# EAGLE design micro_mirror4 (EAGLE 8.2.2)
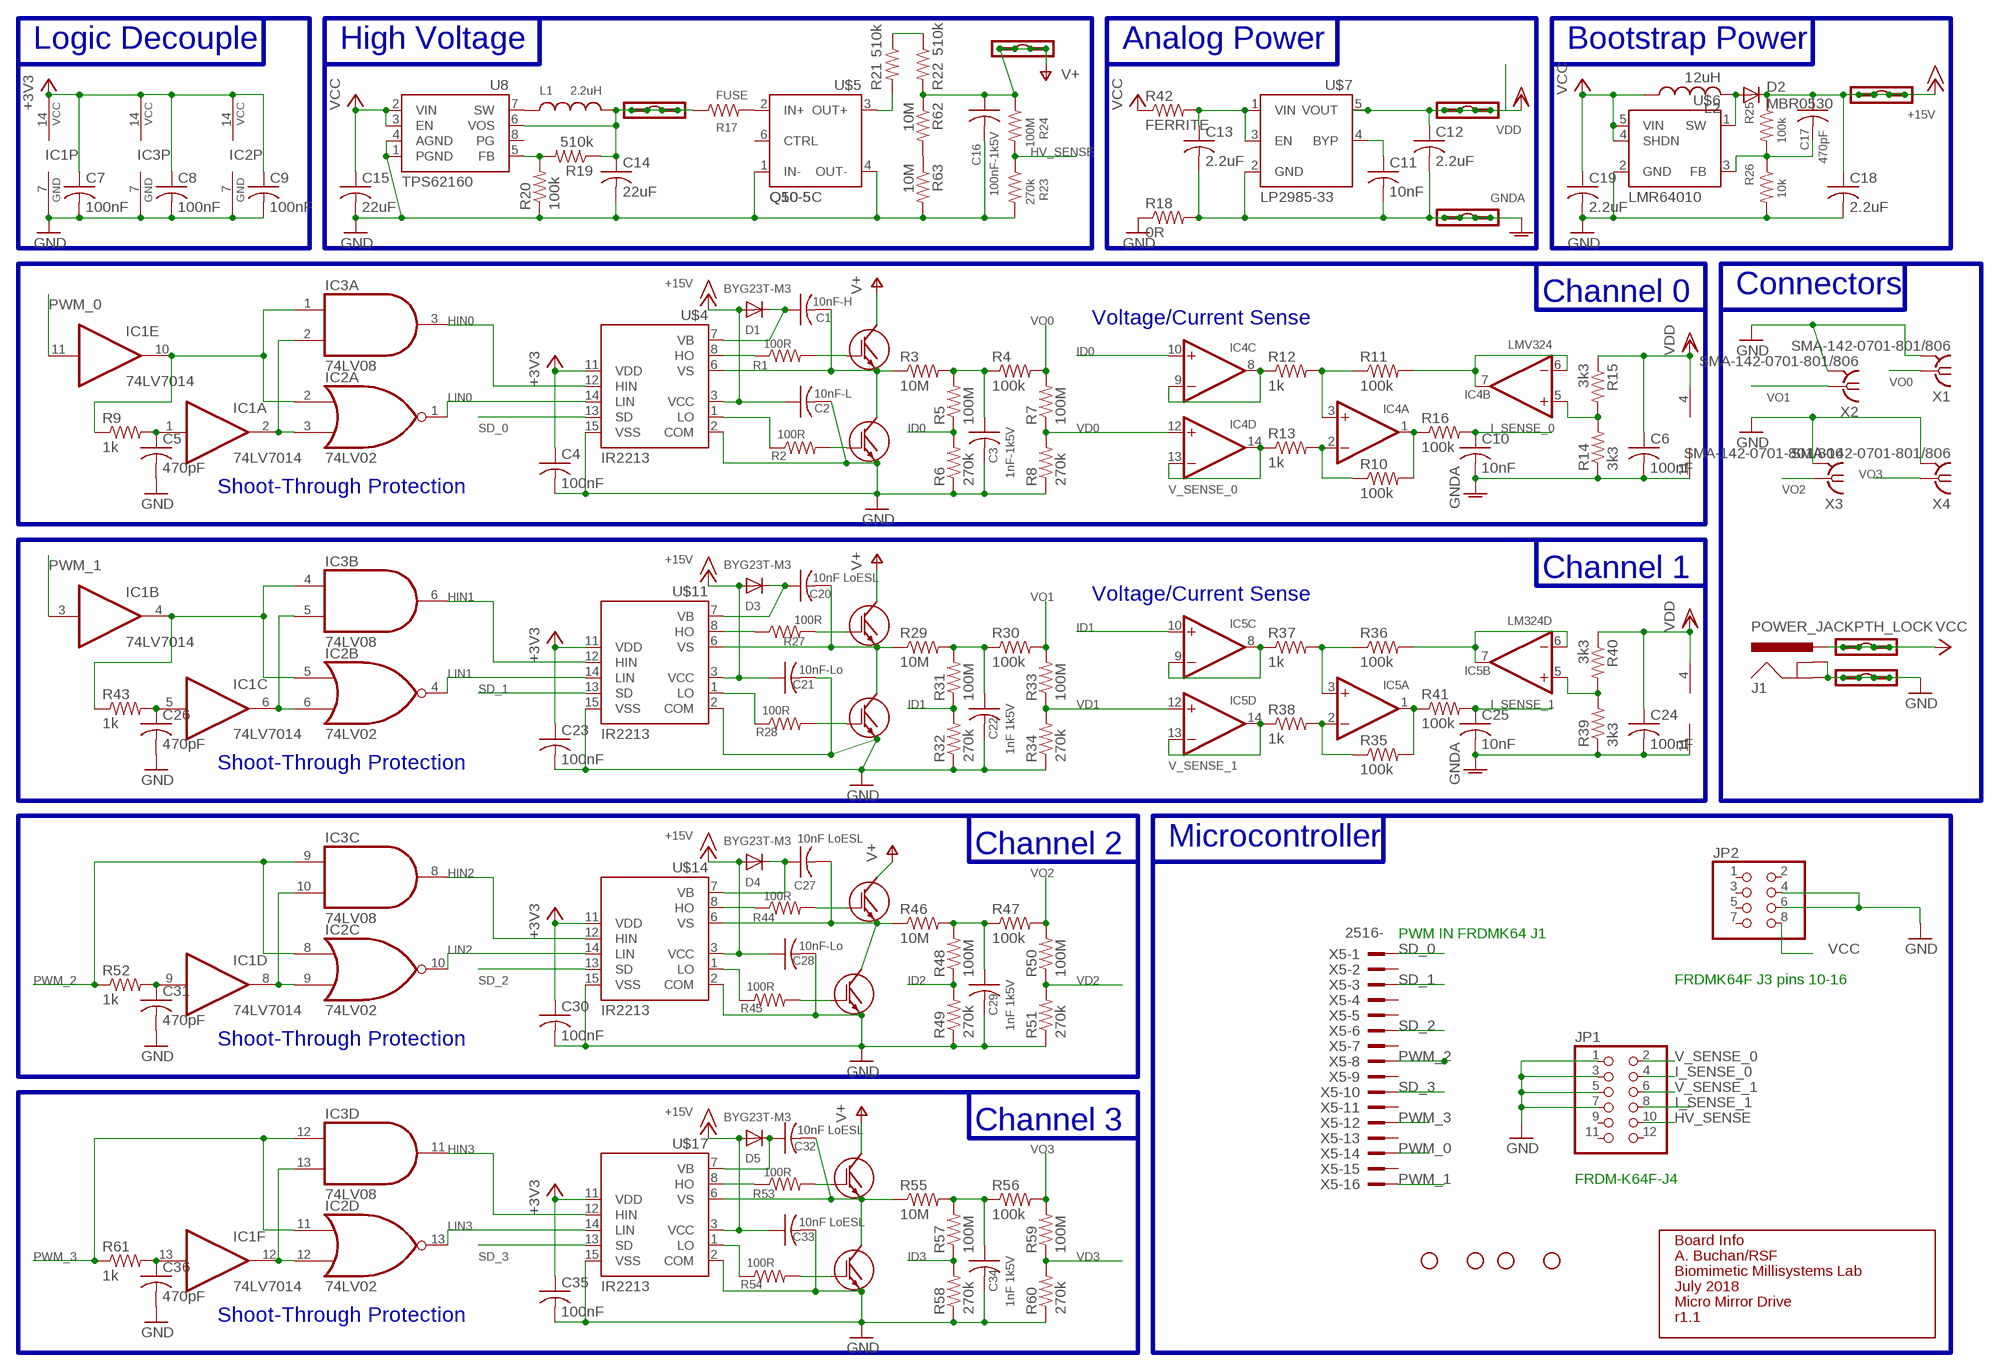
[diagram p0: schematic, sheet 1]

## Parts
15V_OUT  M04LOCK  [1X04_LOCK]
C1  10nF-H  C-USC1206  [C1206]
C2  10nF-L  C-USC1206  [C1206]
C3  1nF-1k5V  C-USC1206  [C1206]
C4  100nF  C-USC1206  [C1206]
C5  470pF  C-USC1206  [C1206]
C6  100nF  C-USC1206  [C1206]
C7  100nF  C-USC1206  [C1206]
C8  100nF  C-USC1206  [C1206]
C9  100nF  C-USC1206  [C1206]
C10  10nF  C-USC1206  [C1206]
C11  10nF  C-USC1206  [C1206]
C12  2.2uF  C-USC1206  [C1206]
C13  2.2uF  C-USC1206  [C1206]
C14  22uF  C-USC1206  [C1206]
C15  22uF  C-USC1206  [C1206]
C16  100nF-1k5V  C-USC2225K  [C2225K]
C17  470pF  C-USC1206  [C1206]
C18  2.2uF  C-USC1206  [C1206]
C19  2.2uF  C-USC1206  [C1206]
C20  10nF LoESL  C-USC1206  [C1206]
C21  10nF-Lo  C-USC1206  [C1206]
C22  1nF 1k5V  C-USC1206  [C1206]
C23  100nF  C-USC1206  [C1206]
C24  100nF  C-USC1206  [C1206]
C25  10nF  C-USC1206  [C1206]
C26  470pF  C-USC1206  [C1206]
C27  10nF LoESL  C-USC1206  [C1206]
C28  10nF-Lo  C-USC1206  [C1206]
C29  1nF 1k5V  C-USC1206  [C1206]
C30  100nF  C-USC1206  [C1206]
C31  470pF  C-USC1206  [C1206]
C32  10nF LoESL  C-USC1206  [C1206]
C33  10nF LoESL  C-USC1206  [C1206]
C34  1nF 1k5V  C-USC1206  [C1206]
C35  100nF  C-USC1206  [C1206]
C36  470pF  C-USC1206  [C1206]
D1  BYG23T-M3  DIODE-DO214AC  [DO214AC]
D2  MBR0530  DIODE-SOD123  [SOD123]
D3  BYG23T-M3  DIODE-DO214AC  [DO214AC]
D4  BYG23T-M3  DIODE-DO214AC  [DO214AC]
D5  BYG23T-M3  DIODE-DO214AC  [DO214AC]
GND  M04LOCK  [1X04_LOCK]
GNDA  M04LOCK  [1X04_LOCK]
H5  STAND-OFFTIGHT  [STAND-OFF-TIGHT]
H6  STAND-OFFTIGHT  [STAND-OFF-TIGHT]
H7  STAND-OFFTIGHT  [STAND-OFF-TIGHT]
H8  STAND-OFFTIGHT  [STAND-OFF-TIGHT]
HV_IN  M04LOCK  [1X04_LOCK]
HV_OUT  M04LOCK  [1X04_LOCK]
IC1  74LV7014  7407D  [SO14]
IC2  74LV02  7402D  [SO14]
IC3  74LV08  74S08D  [SO14]
IC4  LMV324  LINEAR_LM324D  [LINEAR_SO14]
IC5  LM324D  [SO14]
J1  POWER_JACKPTH_LOCK  [POWER_JACK_PTH_LOCK]
JP1  PINHD-2X6  [2X06]
JP2  PINHD-2X4  [2X04]
L1  2.2uH  INDUCTOR  [SRN6045]
L2  12uH  L-USL1812  [L1812]
R1  100R  R-US_R1206  [R1206]
R2  100R  R-US_R1206  [R1206]
R3  10M  R-US_R1206  [R1206]
R4  100k  R-US_R1206  [R1206]
R5  100M  R-US_R1206  [R1206]
R6  270k  R-US_R1206  [R1206]
R7  100M  R-US_R1206  [R1206]
R8  270k  R-US_R1206  [R1206]
R9  1k  R-US_R1206  [R1206]
R10  100k  R-US_R1206  [R1206]
R11  100k  R-US_R1206  [R1206]
R12  1k  R-US_R1206  [R1206]
R13  1k  R-US_R1206  [R1206]
R14  3k3  R-US_R1206  [R1206]
R15  3k3  R-US_R1206  [R1206]
R16  100k  R-US_R1206  [R1206]
R17  FUSE  R-US_R1206  [R1206]
R18  0R  R-US_R1206  [R1206]
R19  510k  R-US_R1206  [R1206]
R20  100k  R-US_R1206  [R1206]
R21  510k  R-US_R1206  [R1206]
R22  510k  R-US_R1206  [R1206]
R23  270k  R-US_R1206  [R1206]
R24  100M  R-US_R1206  [R1206]
R25  100k  R-US_R1206  [R1206]
R26  10k  R-US_R1206  [R1206]
R27  100R  R-US_R1206  [R1206]
R28  100R  R-US_R1206  [R1206]
R29  10M  R-US_R1206  [R1206]
R30  100k  R-US_R1206  [R1206]
R31  100M  R-US_R1206  [R1206]
R32  270k  R-US_R1206  [R1206]
R33  100M  R-US_R1206  [R1206]
R34  270k  R-US_R1206  [R1206]
R35  100k  R-US_R1206  [R1206]
R36  100k  R-US_R1206  [R1206]
R37  1k  R-US_R1206  [R1206]
R38  1k  R-US_R1206  [R1206]
R39  3k3  R-US_R1206  [R1206]
R40  3k3  R-US_R1206  [R1206]
R41  100k  R-US_R1206  [R1206]
R42  FERRITE  R-US_R1206  [R1206]
R43  1k  R-US_R1206  [R1206]
R44  100R  R-US_R1206  [R1206]
R45  100R  R-US_R1206  [R1206]
R46  10M  R-US_R1206  [R1206]
R47  100k  R-US_R1206  [R1206]
R48  100M  R-US_R1206  [R1206]
R49  270k  R-US_R1206  [R1206]
R50  100M  R-US_R1206  [R1206]
R51  270k  R-US_R1206  [R1206]
R52  1k  R-US_R1206  [R1206]
R53  100R  R-US_R1206  [R1206]
R54  100R  R-US_R1206  [R1206]
R55  10M  R-US_R1206  [R1206]
R56  100k  R-US_R1206  [R1206]
R57  100M  R-US_R1206  [R1206]
R58  270k  R-US_R1206  [R1206]
R59  100M  R-US_R1206  [R1206]
R60  270k  R-US_R1206  [R1206]
R61  1k  R-US_R1206  [R1206]
R62  10M  R-US_R1206  [R1206]
R63  10M  R-US_R1206  [R1206]
U8  TPS62160  [TSSOP8]
U$2  HGTD1N120BNS  [TO252]
U$3  HGTD1N120BNS  [TO252]
U$4  IR2213  [SO16L]
U$5  Q50-5C  [Q50-5C]
U$6  LMR64010  [SOT23-5]
U$7  LP2985-33  [SOT23-5]
U$9  HGTD1N120BNS  [TO252]
U$10  HGTD1N120BNS  [TO252]
U$11  IR2213  [SO16L]
U$12  HGTD1N120BNS  [TO252]
U$13  HGTD1N120BNS  [TO252]
U$14  IR2213  [SO16L]
U$15  HGTD1N120BNS  [TO252]
U$16  HGTD1N120BNS  [TO252]
U$17  IR2213  [SO16L]
U$18  INFO  [INFO]
VCC  M04LOCK  [1X04_LOCK]
VDDA  M04LOCK  [1X04_LOCK]
X1  SMA-142-0701-801/806  [J502-ND-142-0701-801/806]
X2  SMA-142-0701-801/806  [J502-ND-142-0701-801/806]
X3  SMA-142-0701-801/806  [J502-ND-142-0701-801/806]
X4  SMA-142-0701-801/806  [J502-ND-142-0701-801/806]
X5  2516-  [PAK100/2500-16]

## Nets
+15V: 15V_OUT.1 15V_OUT.2 15V_OUT.3 15V_OUT.4 C2.1 C17.1 C18.1 C21.1 C28.1 C33.1 D1.A D2.C D3.A D4.A D5.A R25.1 U$4.3(VCC) U$11.3(VCC) U$14.3(VCC) U$17.3(VCC)
GND: C2.2 C3.2 C4.2 C5.2 C7.2 C8.2 C9.2 C14.2 C15.2 C16.2 C18.2 C19.2 C21.2 C22.2 C23.2 C26.2 C28.2 C29.2 C30.2 C31.2 C33.2 C34.2 C35.2 C36.2 GND.1 GND.2 GND.3 GND.4 IC1.7(P:GND) IC2.7(P:GND) IC3.7(P:GND) J1.GND J1.GNDBREAK JP1.1 JP1.3 JP1.5 JP1.7 JP2.4 JP2.6 R6.1 R8.1 R18.1 R20.1 R23.2 R26.2 R32.1 R34.1 R49.1 R51.1 R58.1 R60.1 R63.2 U8.1(PGND) U8.4(AGND) U$3.2(E) U$4.2(COM) U$4.15(VSS) U$5.1(IN-) U$5.4(OUT-) U$6.2(GND) U$10.2(E) U$11.2(COM) U$11.15(VSS) U$13.2(E) U$14.2(COM) U$14.15(VSS) U$16.2(E) U$17.2(COM) U$17.15(VSS) X1.G@1 X1.G@2 X1.G@3 X1.G@4 X2.G@1 X2.G@2 X2.G@3 X2.G@4 X3.G@1 X3.G@2 X3.G@3 X3.G@4 X4.G@1 X4.G@2 X4.G@3 X4.G@4
GNDA: C6.2 C10.2 C11.2 C12.2 C13.2 C24.2 C25.2 GNDA.1 GNDA.2 GNDA.3 GNDA.4 IC4.11(P:V-) IC5.11(P:V-) R14.1 R18.2 R39.1 U$7.2(GND)
HIN0: IC3.3(A:O) U$4.12(HIN)
HIN1: IC3.6(B:O) U$11.12(HIN)
HIN2: IC3.8(C:O) U$14.12(HIN)
HIN3: IC3.11(D:O) U$17.12(HIN)
HV_SENSE: JP1.10 R23.1 R24.2
I_SENSE_0: C10.1 JP1.4 R16.2
I_SENSE_1: C25.1 JP1.8 R41.2
ID0: IC4.10(C:+IN) R5.1 R6.2
ID1: IC5.10(C:+IN) R31.1 R32.2
ID2: R48.1 R49.2
ID3: R57.1 R58.2
LIN0: IC2.1(A:O) U$4.14(LIN)
LIN1: IC2.4(B:O) U$11.14(LIN)
LIN2: IC2.10(C:O) U$14.14(LIN)
LIN3: IC2.13(D:O) U$17.14(LIN)
N$1: R1.2 U$2.1(G)
N$2: R2.2 U$3.1(G)
N$3: C1.2 R3.1 U$2.2(E) U$3.3(C) U$4.6(VS)
N$4: C3.1 R3.2 R4.1 R5.2
N$5: C1.1 D1.C U$4.7(VB)
N$6: R1.1 U$4.8(HO)
N$7: R2.1 U$4.1(LO)
N$8: IC1.2(A:O) IC2.3(A:I1) IC3.2(A:I1)
N$9: IC4.8(C:OUT) IC4.9(C:-IN) R12.1
N$10: C5.1 IC1.1(A:I) R9.2
N$11: IC4.1(A:OUT) R10.2 R16.1
N$12: R17.2 U$5.2(IN+)
N$13: IC4.2(A:-IN) R10.1 R13.2
N$14: IC4.3(A:+IN) R11.1 R12.2
N$15: IC4.5(B:+IN) R14.2 R15.2
N$16: IC4.6(B:-IN) IC4.7(B:OUT) R11.2
N$17: L1.1 U8.7(SW)
N$18: C14.1 HV_IN.1 HV_IN.2 HV_IN.3 HV_IN.4 L1.2 R17.1 R19.1 U8.6(VOS)
N$19: C11.1 U$7.4(BYP)
N$20: R19.2 R20.2 U8.5(FB)
N$21: D2.A L2.2 U$6.1(SW)
N$22: R27.2 U$9.1(G)
N$23: C17.2 R25.2 R26.1 U$6.3(FB)
N$24: R21.1 R22.1
N$25: R28.2 U$10.1(G)
N$26: C20.2 R29.1 U$9.2(E) U$10.3(C) U$11.6(VS)
N$27: R27.1 U$11.8(HO)
N$28: R28.1 U$11.1(LO)
N$29: C20.1 D3.C U$11.7(VB)
N$30: C22.1 R29.2 R30.1 R31.2
N$31: IC5.8(C:OUT) IC5.9(C:-IN) R37.1
N$32: IC5.2(A:-IN) R35.1 R38.2
N$33: IC5.3(A:+IN) R36.1 R37.2
N$34: IC5.6(B:-IN) IC5.7(B:OUT) R36.2
N$35: IC5.1(A:OUT) R35.2 R41.1
N$36: IC5.5(B:+IN) R39.2 R40.2
N$37: C13.1 R42.2 U$7.1(VIN) U$7.3(EN)
N$38: IC1.6(C:O) IC2.6(B:I1) IC3.5(B:I1)
N$39: C26.1 IC1.5(C:I) R43.2
N$40: R44.2 U$12.1(G)
N$41: R45.2 U$13.1(G)
N$42: C27.2 R46.1 U$12.2(E) U$13.3(C) U$14.6(VS)
N$43: R44.1 U$14.8(HO)
N$44: R45.1 U$14.1(LO)
N$45: C27.1 D4.C U$14.7(VB)
N$46: C29.1 R46.2 R47.1 R48.2
N$47: IC1.8(D:O) IC2.9(C:I1) IC3.10(C:I1)
N$48: R53.2 U$15.1(G)
N$49: C31.1 IC1.9(D:I) R52.2
N$50: R54.2 U$16.1(G)
N$51: C32.2 R55.1 U$15.2(E) U$16.3(C) U$17.6(VS)
N$52: R53.1 U$17.8(HO)
N$53: R54.1 U$17.1(LO)
N$54: C32.1 D5.C U$17.7(VB)
N$55: C34.1 R55.2 R56.1 R57.2
N$56: IC1.12(F:O) IC2.12(D:I1) IC3.13(D:I1)
N$57: C36.1 IC1.13(F:I) R61.2
N$58: IC1.4(B:O) IC2.5(B:I0) IC3.4(B:I0) R43.1
N$59: IC1.10(E:O) IC2.2(A:I0) IC3.1(A:I0) R9.1
N$60: R21.2 U$5.3(OUT+)
N$62: R62.2 R63.1
PWM_0: IC1.11(E:I) X5.14
PWM_1: IC1.3(B:I) X5.16
PWM_2: IC2.8(C:I0) IC3.9(C:I0) R52.1 X5.8
PWM_3: IC2.11(D:I0) IC3.12(D:I0) R61.1 X5.12
SD_0: U$4.13(SD) X5.1
SD_1: U$11.13(SD) X5.3
SD_2: U$14.13(SD) X5.6
SD_3: U$17.13(SD) X5.10
V+: C16.1 HV_OUT.1 HV_OUT.2 HV_OUT.3 HV_OUT.4 R22.2 R24.1 R62.1 U$2.3(C) U$9.3(C) U$12.3(C) U$15.3(C)
V_SENSE_0: IC4.13(D:-IN) IC4.14(D:OUT) JP1.2 R13.1
V_SENSE_1: IC5.13(D:-IN) IC5.14(D:OUT) JP1.6 R38.1
VCC: C15.1 C19.1 J1.PWR JP2.8 L2.1 R42.1 U8.2(VIN) U8.3(EN) U$6.4(SHDN) U$6.5(VIN) VCC.1 VCC.2 VCC.3 VCC.4
VD0: IC4.12(D:+IN) R7.1 R8.2
VD1: IC5.12(D:+IN) R33.1 R34.2
VD2: R50.1 R51.2
VD3: R59.1 R60.2
VDD: C6.1 C24.1 IC4.4(P:V+) IC5.4(P:V+) R15.1 R40.1
VDDA: C4.1 C7.1 C8.1 C9.1 C12.1 C23.1 C30.1 C35.1 IC1.14(P:VCC) IC2.14(P:VCC) IC3.14(P:VCC) U$4.11(VDD) U$7.5(VOUT) U$11.11(VDD) U$14.11(VDD) U$17.11(VDD) VDDA.1 VDDA.2 VDDA.3 VDDA.4 ; supply symbol labelled +3V3, VDD
VO0: R4.2 R7.2 X1.1
VO1: R30.2 R33.2 X2.1
VO2: R47.2 R50.2 X3.1
VO3: R56.2 R59.2 X4.1
Unconnected: JP1.9 JP1.11 JP1.12 JP2.1 JP2.2 JP2.3 JP2.5 JP2.7 U8.8(PG) U$5.6(CTRL) X5.2 X5.4 X5.5 X5.7 X5.9 X5.11 X5.13 X5.15

## Buses
B$1
B$2
B$3
B$4
B$5
B$6
B$7
B$8

## Notes on the sheet
- Logic Decouple | High Voltage | Analog Power | Bootstrap Power
- Channel 0
- Connectors
- Voltage/Current Sense
- Shoot-Through Protection
- Channel 1
- Voltage/Current Sense
- Shoot-Through Protection
- Channel 2
- Microcontroller
- PWM IN FRDMK64 J1
- FRDMK64F J3 pins 10-16
- Shoot-Through Protection
- Channel 3
- FRDM-K64F-J4
- Shoot-Through Protection

## Library data of the parts
15V_OUT GND GNDA HV_IN HV_OUT VCC VDDA = modular_robotics:M04: Header 4 Standard 4-pin 0.1" header. Use with straight break away headers (SKU : PRT-00116), right angle break away headers (PRT-00553), swiss pins (PRT-00743), machine pins (PRT-00117), and female headers (PRT-00115). Molex polarized connector foot print use with SKU : PRT-08231 with associated crimp pins and housings. 1MM SMD Version SKU: PRT-10208
C1-C36 = rcl:C-US: CAPACITOR, American symbol
D1-D5 = diode:DIODE-: DIODE
H5-H8 = SparkFun-Hardware:STAND-OFF: Stand Off Drill holes for mechanically mounting via screws, standoffs, etc. Note: Use the keepout ring to avoid running the screw head into surrounding components. Variant Overviews STAND-OFF - Mechanical footprint for a #4 phillips button head screw. STAND-OFF-TIGHT - Mechanical footprint for a #4 phillips button head screw, Example SparkFun Products Screw - Phillips Head (1/4", 4-40, 10 pack) <https://www.sparkfun.com/products/10453> (PRT-10453) Screw - Phillips Head (1/2", 4-40, 10 pack) <https://www.sparkfun.com/products/10452> (PRT-10452) Screw - Phillips Head (3/4", 4-40, 10 pack) <https://www.sparkfun.com/products/10451> (PRT-10451) Screw - Phillips Head (1", 4-40, 10 pack) <https://www.sparkfun.com/products/10450> (PRT-10450)
IC1 = 74xx-us:74*07: Hex BUFFER, open collector high-voltage output
IC2 = 74xx-us:74*02: Quad 2-input NOR gate
IC3 = 74xx-us:74*08: Quad 2-input AND gate
IC4 = micro_mirror3:LINEAR_LM324: OP AMP; VERSION: LMV324
IC5 = linear:LM324: OP AMP
J1 = SparkFun-Connectors:POWER_JACK: Power Jack This is the standard 5.5mm barrel jack for power. The PTH is the most common, proven, reliable, footprint. The Slot footprint only works if the mill layer is transmitted to the PCB fab house so be warned. Mating wall wart : TOL-00298 (and others); DIMENSIONS: 5.5mm-diam; PROD_ID: PRT-00119
JP1 = pinhead:PINHD-2X6: PIN HEADER
JP2 = pinhead:PINHD-2X4: PIN HEADER
L1 = modular_robotics:INDUCTOR
L2 = rcl:L-US: INDUCTOR, American symbol
R1-R63 = rcl:R-US_: RESISTOR, American symbol
U8 = modular_robotics:TPS62160
U$2 U$3 U$9 U$10 U$12 U$13 U$15 U$16 = modular_robotics:HGTD1N120BNS
U$4 U$11 U$14 U$17 = modular_robotics:IR2213
U$5 = modular_robotics:Q50-5C; EMCO: Q10-5
U$6 = modular_robotics:LMR64010
U$7 = modular_robotics:LP2985-33
U$18 = modular_robotics:INFO; AUTHOR: A. Buchan/RSF; DATE: July 2018; DESIGN: Micro Mirror Drive; ORGANIZATION: Biomimetic Millisystems Lab; REVISION: r1.1
X1-X4 = con-coax:SMA-: SMA 50 Ohm End Launch Jack Receptacle - Round Contact Johnson Components Source: www.johnsoncomponents.com .. J502-ND.pdf; MF: JOHNSON COMPONENTS; MPN: 142-0701-801; OC_FARNELL: 1608592; OC_NEWARK: 90F2624
X5 = con-3m:2516-: 3M (TM) Pak 100 4-Wall Header Source: 3M; OC_FARNELL: unknown; OC_NEWARK: unknown

## Net classes
0 default: clearance 0.205 mm

## Board
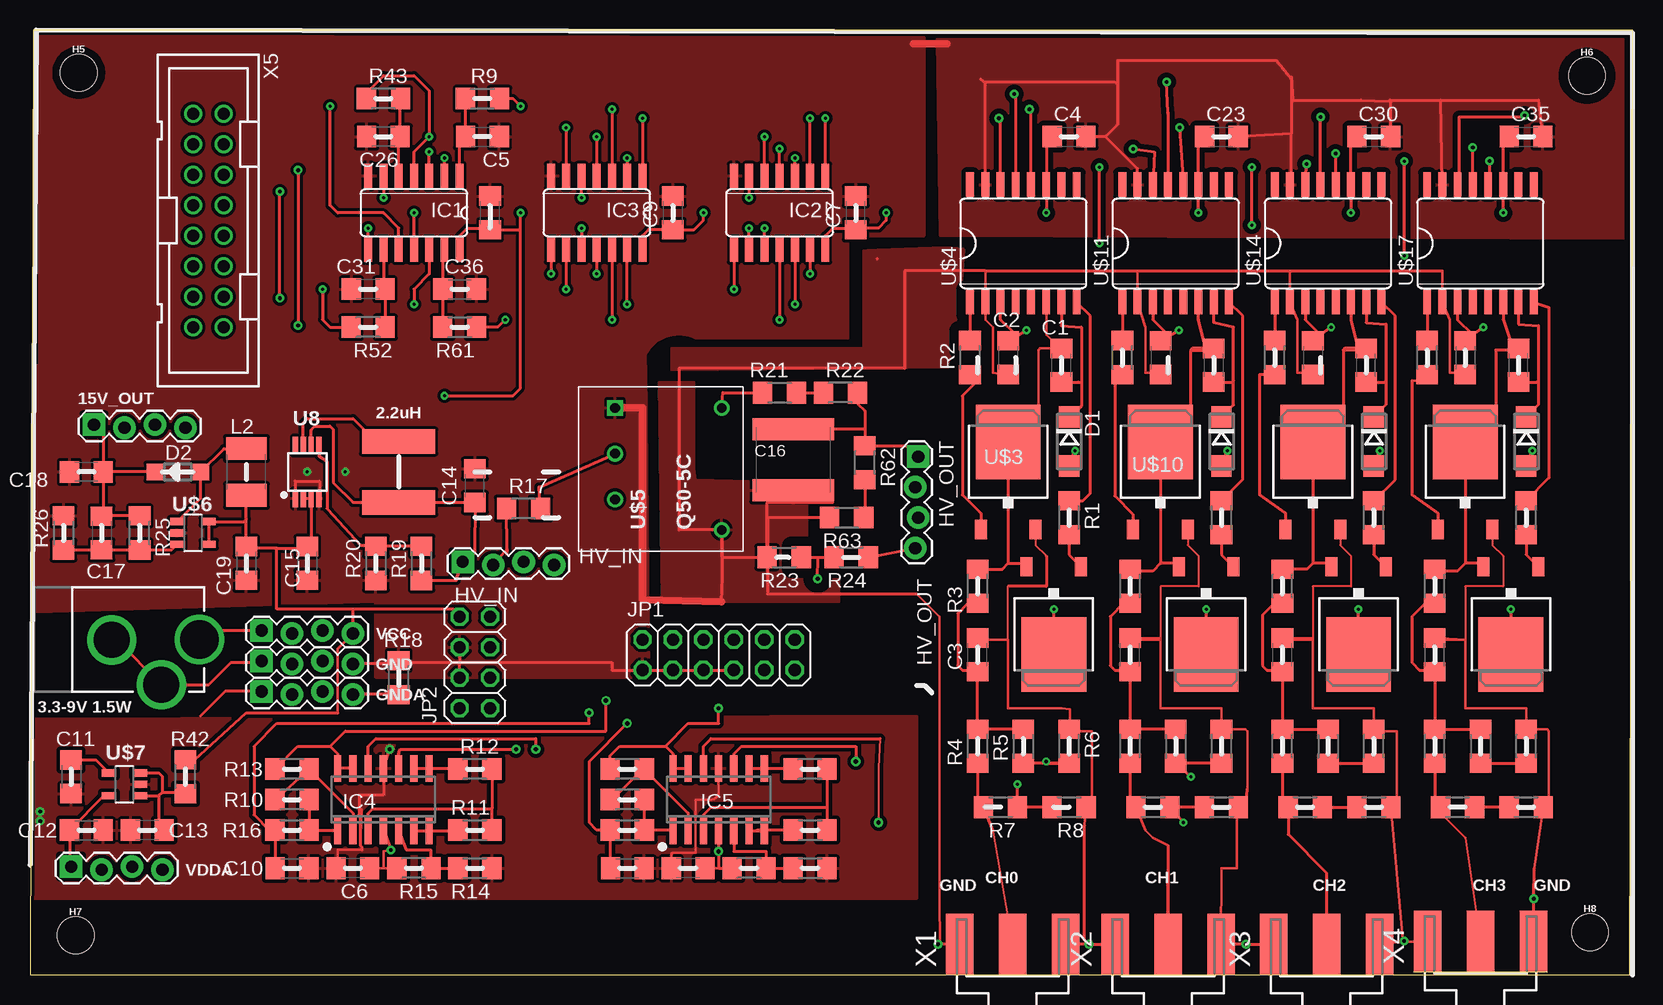
[diagram p1: board, top side]
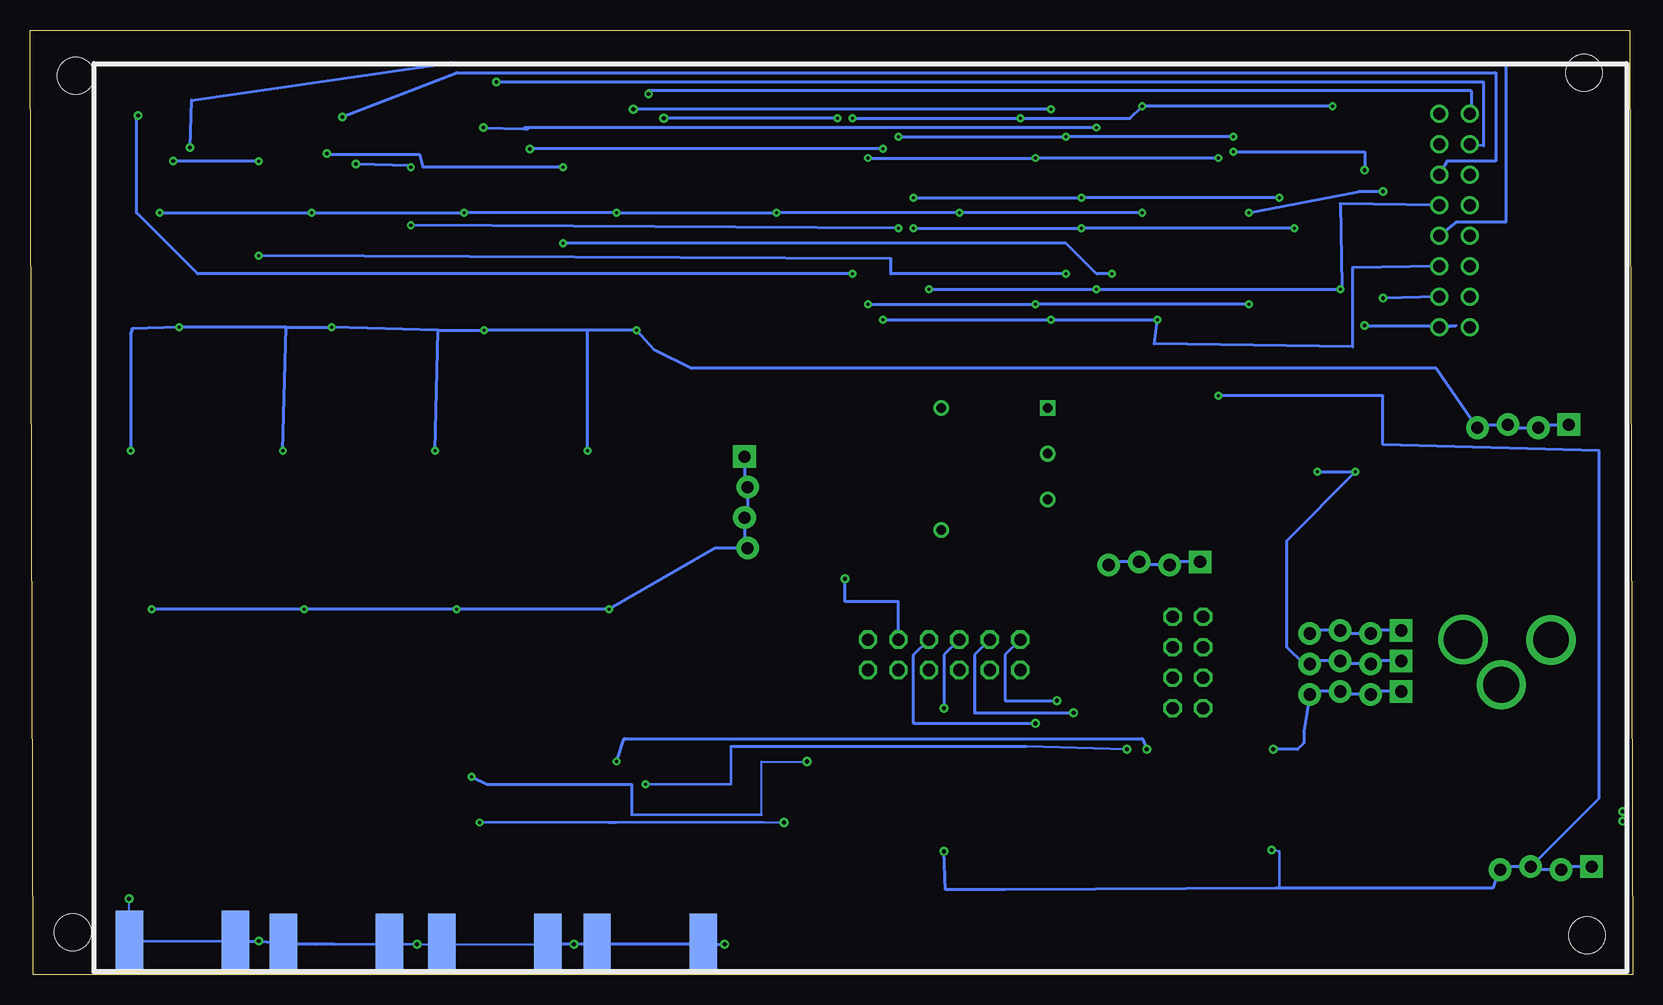
[diagram p2: board, bottom side, seen from below]

Size 133.6 x 78.74 mm. Coordinates in mm from the lower left corner, seen from the top.
Outline: 0,0 133.35,0 133.6,78.74 0.25,78.74 0,0
Copper layers (1*16): Top 0.035mm / dielectric 1.5mm / Bottom 0.035mm
Design rules "default *": minimum track width 6mil, minimum drill 10mil, track to track 6mil, track to pad 6mil, pad to pad 6mil, via to via 6mil, smd to smd 6mil, copper to edge 10mil, drill to drill 8mil, minimum pad ring 10mil, minimum via ring 8mil, stop-mask expansion 4mil, vias tented up to drill 0mil, thermal gap 10mil

### Footprints (pad centres in the part's own frame; a part is rotated, then mirrored left to right if it is on the bottom)
1X04_LOCK = drill 1.016 pad 1.88 square: 1 0,0.127 | drill 1.016 pad 1.88: 2 2.54,-0.127; 3 5.08,0.127; 4 7.62,-0.127
C1206 = smd 1.6 x 1.8: 1 -1.4,0; 2 1.4,0
C2225K = smd 1.85 x 6.8: 1 -2.55,0; 2 2.55,0
DO214AC = smd 1.8 x 1.7: A 2.05,0; C -2.05,0
SOD123 = smd 1.4 x 1.4: A 1.9,0; C -1.9,0
STAND-OFF-TIGHT = hole 3.048: 0,0
SO14 = smd 0.66 x 2.032: 1 -3.81,-3.073; 2 -2.54,-3.073; 3 -1.27,-3.073; 4 0,-3.073; 5 1.27,-3.073; 6 2.54,-3.073; 7 3.81,-3.073; 8 3.81,3.073; 9 2.54,3.073; 10 1.27,3.073; 11 0,3.073; 12 -1.27,3.073; 13 -2.54,3.073; 14 -3.81,3.073
LINEAR_SO14 = smd 0.6 x 2.2: 1 -3.81,-2.6; 2 -2.54,-2.6; 3 -1.27,-2.6; 4 0,-2.6; 5 1.27,-2.6; 6 2.54,-2.6; 7 3.81,-2.6; 8 3.81,2.6; 9 2.54,2.6; 10 1.27,2.6; 11 0,2.6; 12 -1.27,2.6; 13 -2.54,2.6; 14 -3.81,2.6
SO14' = smd 0.6 x 2.2: 1 -3.81,-2.6; 2 -2.54,-2.6; 3 -1.27,-2.6; 4 0,-2.6; 5 1.27,-2.6; 6 2.54,-2.6; 7 3.81,-2.6; 8 3.81,2.6; 9 2.54,2.6; 10 1.27,2.6; 11 0,2.6; 12 -1.27,2.6; 13 -2.54,2.6; 14 -3.81,2.6
POWER_JACK_PTH_LOCK = drill 2.997 pad 4.115: GND 0.025,6.557; GNDBREAK 3.762,10.7 | drill 3.2 pad 4.115: PWR 0,13.878
2X06 = drill 1.016 octagon: 1 -6.35,-1.27; 2 -6.35,1.27; 3 -3.81,-1.27; 4 -3.81,1.27; 5 -1.27,-1.27; 6 -1.27,1.27; 7 1.27,-1.27; 8 1.27,1.27; 9 3.81,-1.27; 10 3.81,1.27; 11 6.35,-1.27; 12 6.35,1.27
2X04 = drill 1.016 octagon: 1 -3.81,-1.27; 2 -3.81,1.27; 3 -1.27,-1.27; 4 -1.27,1.27; 5 1.27,-1.27; 6 1.27,1.27; 7 3.81,-1.27; 8 3.81,1.27
SRN6045 = smd 2.032 x 6.096: 1 -2.54,0; 2 2.54,0
L1812 = smd 1.9 x 3.4: 1 -1.95,0; 2 1.95,0
R1206 = smd 1.6 x 1.803: 1 -1.422,0; 2 1.422,0
TSSOP8 = smd 0.45 x 1.45: 1 -0.975,-2.2; 2 -0.325,-2.2; 3 0.325,-2.2; 4 0.975,-2.2; 5 0.975,2.2; 6 0.325,2.2; 7 -0.325,2.2; 8 -0.975,2.2
TO252 = smd 1 x 1.6: 1 -2.28,-4.8; 2 2.28,-4.8 | smd 5.4 x 6.2: 3 0,2.5
SO16L = smd 0.66 x 2.032: 1 -4.445,-4.902; 2 -3.175,-4.902; 3 -1.905,-4.902; 4 -0.635,-4.902; 5 0.635,-4.902; 6 1.905,-4.902; 7 3.175,-4.902; 8 4.445,-4.902; 9 4.445,4.902; 10 3.175,4.902; 11 1.905,4.902; 12 0.635,4.902; 13 -0.635,4.902; 14 -1.905,4.902; 15 -3.175,4.902; 16 -4.445,4.902
Q50-5C = drill 0.8 square: 1 0,0 | drill 0.8: 2 0,-3.81; 3 8.89,0; 4 8.89,-10.16; 6 0,-7.62
SOT23-5 = smd 0.6 x 1.2: 1 -0.95,-1.306; 2 0,-1.306; 3 0.95,-1.306; 4 0.95,1.306; 5 -0.95,1.306
J502-ND-142-0701-801/806 = smd 5.08 x 2.286: 1 2.565,0; G@1 2.565,4.42; G@2 2.565,-4.42 | smd 5.08 x 2.286 bottom: G@3 2.565,4.42; G@4 2.565,-4.42
PAK100/2500-16 = drill 1 pad 1.422: 1 -8.89,-1.27; 2 -8.89,1.27; 3 -6.35,-1.27; 4 -6.35,1.27; 5 -3.81,-1.27; 6 -3.81,1.27; 7 -1.27,-1.27; 8 -1.27,1.27; 9 1.27,-1.27; 10 1.27,1.27; 11 3.81,-1.27; 12 3.81,1.27; 13 6.35,-1.27; 14 6.35,1.27; 15 8.89,-1.27; 16 8.89,1.27

### Placement (x,y rotation side)
15V_OUT  5.33,45.72 0 top
C1  85.98,50.8 90 top
C2  81.53,51.44 270 top
C3  78.99,26.67 90 top
C4  86.61,69.85 0 top
C5  37.72,69.85 0 top
C6  26.92,8.89 180 top
C7  68.83,63.5 90 top
C8  38.35,63.5 90 top
C9  53.59,63.5 90 top
C10  21.84,8.89 0 top
C11  3.43,16.51 270 top
C12  4.7,12.06 0 top
C13  9.78,12.06 180 top
C14  37.08,40.77 90 top
C15  23.11,34.29 270 top
C16  63.63,42.93 270 top
C17  5.97,36.83 270 top
C18  4.7,41.91 180 top
C19  18.03,34.29 270 top
C20  98.68,50.8 90 top
C21  94.23,51.44 270 top
C22  91.69,26.67 90 top
C23  99.31,69.85 0 top
C24  54.86,8.89 180 top
C25  49.78,8.89 0 top
C26  29.46,69.85 180 top
C27  111.38,50.8 90 top
C28  106.93,51.44 270 top
C29  104.39,26.67 90 top
C30  112.01,69.85 0 top
C31  28.19,57.15 180 top
C32  124.08,50.8 90 top
C33  119.63,51.44 270 top
C34  117.09,26.67 90 top
C35  124.71,69.85 0 top
C36  35.81,57.15 0 top
D1  86.61,44.45 270 top
D2  12.32,41.91 0 top
D3  99.31,44.45 270 top
D4  112.01,44.45 270 top
D5  124.71,44.45 270 top
GND  19.3,26.04 0 top
GNDA  19.3,23.5 0 top
H5  4.06,75.18 0 top
H6  129.79,74.93 0 top
H7  3.81,3.3 0 top
H8  130.05,3.56 0 top
HV_IN  36.07,34.29 0 top
HV_OUT  73.91,43.18 270 top
IC1  32,63.5 180 top
IC2  62.48,63.5 180 top
IC3  47.24,63.5 180 top
IC4  29.46,14.61 0 top
IC5  LM324D  [SO14']  57.4,14.61 0 top
J1  0.25,27.94 270 top
JP1  57.4,26.67 0 top
JP2  37.08,26.04 90 top
L1  30.73,41.91 270 top
L2  18.03,41.91 90 top
R1  86.61,38.1 270 top
R2  78.36,51.44 270 top
R3  78.99,32.38 270 top
R4  78.99,19.05 270 top
R5  82.8,19.05 90 top
R6  86.61,19.05 270 top
R7  80.9,13.97 180 top
R8  86.61,13.97 180 top
R9  37.72,73.03 180 top
R10  21.84,14.61 0 top
R11  37.08,12.06 180 top
R12  37.08,17.14 0 top
R13  21.84,17.14 0 top
R14  37.08,8.89 180 top
R15  32,8.89 0 top
R16  21.84,12.06 180 top
R17  41.15,38.86 0 top
R18  30.73,24.77 270 top
R19  32.64,34.29 90 top
R20  28.83,34.29 90 top
R21  62.48,48.51 180 top
R22  67.56,48.51 0 top
R23  62.86,34.8 180 top
R24  68.45,34.8 180 top
R25  9.14,36.83 270 top
R26  2.79,36.83 90 top
R27  99.31,38.1 270 top
R28  91.06,51.44 270 top
R29  91.69,32.38 270 top
R30  91.69,19.05 270 top
R31  95.5,19.05 90 top
R32  99.31,19.05 270 top
R33  93.6,13.97 180 top
R34  99.31,13.97 180 top
R35  49.78,14.61 0 top
R36  65.02,12.06 180 top
R37  65.02,17.14 0 top
R38  49.78,17.14 0 top
R39  65.02,8.89 180 top
R40  59.94,8.89 0 top
R41  49.78,12.06 180 top
R42  12.95,16.51 270 top
R43  29.46,73.03 0 top
R44  112.01,38.1 270 top
R45  103.76,51.44 270 top
R46  104.39,32.38 270 top
R47  104.39,19.05 270 top
R48  108.2,19.05 90 top
R49  112.01,19.05 270 top
R50  106.3,13.97 180 top
R51  112.01,13.97 180 top
R52  28.19,53.98 0 top
R53  124.71,38.1 270 top
R54  116.46,51.44 270 top
R55  117.09,32.38 270 top
R56  117.09,19.05 270 top
R57  120.9,19.05 90 top
R58  124.71,19.05 270 top
R59  119,13.97 180 top
R60  124.71,13.97 180 top
R61  35.81,53.98 180 top
R62  69.6,42.67 270 top
R63  68.07,38.1 180 top
U8  23.11,41.91 0 top
U$2  85.34,29.21 180 top
U$3  81.53,41.91 0 top
U$4  82.8,60.96 0 top
U$5  48.77,47.24 0 top
U$6  13.59,36.83 270 top
U$7  7.87,15.88 90 top
U$9  98.04,29.21 180 top
U$10  94.23,41.91 0 top
U$11  95.5,60.96 0 top
U$12  110.74,29.21 180 top
U$13  106.93,41.91 0 top
U$14  108.2,60.96 0 top
U$15  123.44,29.21 180 top
U$16  119.63,41.91 0 top
U$17  120.9,60.96 0 top
U$18  54.36,72.52 0 top
VCC  19.3,28.57 0 top
VDDA  3.43,8.89 0 top
X1  81.92,0 90 top
X2  94.87,0 90 top
X3  108.08,0 90 top
X4  120.9,0.25 90 top
X5  14.86,62.87 270 top

### Tracks (layer width: path | path; a pad name or v marks a point on that pad's centre or on a via)
+15V  (via drill 0.25)
  Top 0.254: U$4.3 80.9,54.61 82.17,53.34 C2.1 v83.06,53.72 | U$11.3 93.6,54.61 94.87,53.34 C21.1 v95.76,53.72 | R25.1 5.99,38.25 C17.1 6.1,38.36 C18.1 | D2.C C18.1 | 15V_OUT.1 6.1,45.08 C18.1 | D1.A v87.12,43.69 | D3.A v99.82,43.69 | U$14.3 106.3,54.61 107.57,53.34 C28.1 v108.46,53.98 | U$17.3 119,54.61 120.27,53.34 C33.1 v121.16,53.98 | 124.71,42.55 D5.A v125.22,43.69 | D4.A v112.52,43.69
  Bottom 0.254: 87.12,53.72 v83.06,53.72 81.53,52.07 78.49,50.55 16.38,50.55 15V_OUT.4 12.7,45.85 15V_OUT.3 10.16,45.59 15V_OUT.2 7.62,45.85 15V_OUT.1 | 87.12,53.72 v95.76,53.72 99.57,53.72 | v87.12,43.69 87.12,53.72 | v99.82,43.69 99.57,53.72 | 99.57,53.72 v108.46,53.98 112.27,53.98 | v112.52,43.69 112.27,53.98 | 112.27,53.98 v121.16,53.98 125.09,53.85 125.22,53.47 v125.22,43.69
GND  (via drill 0.25, 0.3 pad 0.65, 0.35)
  Top 0.152: U$3.2 83.81,35.82 84.71,34.92 | 81.53,27.94 81.53,32.38 | U$10.2 96.51,35.82 97.41,34.92 97.41,32.38 94.23,32.38 94.23,27.94 | U$13.2 109.21,35.82 110.11,34.92 110.11,32.38 106.93,32.38 106.93,27.94 | U$16.2 121.91,35.82 122.81,34.92 122.81,32.38 119.63,32.38 119.63,27.94
  Top 0.203: C2.2 81.03,50.03 80.26,50.16 80.26,53.98 79.63,54.61 U$4.2 79.63,58.67 | C21.2 93.73,49.4 94.23,50.16 92.96,50.16 92.96,53.98 U$11.2 92.33,58.67 | C28.2 107.06,50.03 106.3,50.16 105.66,50.16 105.66,54.61 U$14.2 105.03,58.67 | C33.2 119.76,50.16 118.36,50.16 118.36,54.61 U$17.2 117.73,58.67 | 117.09,27.94 119.63,27.94 | C34.2 117.6,28.07 119.63,27.94 | 119.63,27.94 119.63,22.23 124.71,22.23 R58.1 126.47,20.47 126.62,20.32 126.62,14.61 | 106.93,27.94 103.76,27.94 | C29.2 106.8,28.07 106.93,27.94 | 106.93,27.94 106.93,22.23 112.01,22.23 R49.1 112.17,20.32 113.92,20.32 113.92,13.97 | 94.23,27.94 91.69,27.94 | C22.2 94.1,28.07 94.23,27.94 | 94.23,27.94 94.23,22.23 99.31,22.23 R32.1 101.32,20.47 101.47,20.32 101.47,15.49 101.22,13.97 | 125.4,8.9 R60.1 126.39,13.72 126.75,13.72 | R51.1 114.45,2.95 | R34.1 100.58,13.82 100.58,8.89 99.31,8.89 X2.G@2 | 87.91,12.44 R8.1 | R6.1 86.69,20.4 | 86.69,20.4 86.77,20.32 88.52,20.32 88.52,14.61 87.88,13.97 | C3.2 79.12,27.94 81.53,27.94 81.53,22.23 85.98,22.23 86.69,22.15 86.69,20.4 | X1.G@1 75.84,2.56 75.82,6.35 75.82,29.84 73.91,31.75
  Top 0.254: 35.81,26.04 30.89,26.04 R18.1 31.09,25.91 GND.4 | 35.81,26.04 48.51,26.04 48.51,25.4 JP1.1 JP1.3 JP1.5 JP1.7 | J1.GND 7.22,27.91 J1.GNDBREAK 14.91,24.18 16.76,26.04 19.18,26.04 GND.1 | 84.71,34.92 84.71,32.38 81.53,32.38 | JP2.6 35.81,26.04 | JP2.4 35.81,26.04 | R60.1 126.62,14.61 | X4.G@2 v125.35,6.35 125.4,8.9 | 114.63,2.78 v114.54,2.82 X3.G@2 | 114.63,2.78 X4.G@1 | 114.45,2.95 114.63,2.78 | X3.G@1 v101.35,2.54 X2.G@2 | R34.1 101.35,13.97 101.47,15.49 | R51.1 113.92,13.97 | 92.2,65.99 U$11.15 92.33,67.18 89.66,69.85 | U$17.15 117.6,72.9 | 70.61,59.69 70.61,59.67 | 117.73,58.67 105.03,58.67 92.33,58.67 79.63,58.67 72.9,58.67 72.9,50.55 54.1,50.55 54.1,37.08 57.73,37.1 | 57.73,37.1 U$5.4 57.66,34.8 R23.2 61.44,39.34 62.99,39.37 66.92,39.37 C16.2 | 87.88,13.97 R8.1 88.65,13.97 | U$4.15 79.63,74.3 79.5,74.42 | 79.5,74.42 79.25,74.68 | 90.68,74.17 90.68,76.2 103.89,76.2 105.16,74.68 | 105.16,74.68 105.16,70.1 | 105.16,66.29 105.16,70.1 | 105.16,74.68 105.16,74.81 105.28,72.9 110.94,72.9 113.28,72.8 | 113.28,72.8 113.39,72.8 113.41,70.99 C30.2 | 117.6,72.9 125.73,72.9 125.98,70.74 C35.2 | 79.5,74.42 90.42,74.42 90.68,74.17 | 89.66,69.85 C4.2 | 89.66,69.85 90.68,70.87 90.68,74.17 | 105.16,70.1 C23.2 | 113.28,72.8 113.38,72.9 117.6,72.9 | X1.G@1 75.72,2.56 v75.69,2.54 | 86.36,2.59 X1.G@2 88.24,2.56 v88.27,2.54 | v88.27,2.54 87.91,2.9 87.91,12.44 | v88.27,2.54 90.42,2.54 X2.G@1 | U8.1 22.14,41.11 22.1,41.15 24.13,41.15 24.13,39.75 U8.4 | 57.66,31.11 57.72,33.15 57.73,37.1 | R63.2 61.47,38.1 61.47,31.75 73.91,31.75
  Top 0.61: U$5.1 51.05,47.24 51.05,31.24 57.66,31.11 | 73.66,77.6 76.45,77.6
  Bottom 0.152: X2.G@1 X2.G@2 X3.G@1 v101.35,2.54 | X4.G@2 v125.35,6.35
  Bottom 0.203: v101.35,2.54 108.2,2.54 | X4.G@1 X4.G@2
  Bottom 0.254: v26.29,41.91 v23.11,41.91 28.83,36.2 28.83,27.3 27.43,25.91 GND.4 26.67,26.16 GND.3 24.13,25.91 GND.2 21.59,26.16 GND.1 | v75.69,2.54 X1.G@1 86.36,2.56 | X4.G@1 v114.54,2.82 X3.G@2 109.73,2.54 108.2,2.54 | X1.G@2 86.36,2.56 | 86.36,2.56 88.39,2.54 | 88.39,2.54 v88.27,2.54 | 88.39,2.54 X2.G@1
  pour Top (isolate 0.813): 53.47,50.42 77.09,50.67 77.72,58.42 77.85,60.45 76.33,60.58 69.47,60.33 69.47,52.2 53.47,52.2
  pour Top (isolate 0.254): 51.31,50.8 51.56,24.77 28.83,24.77 28.83,31.11 0.51,30.23 0.25,50.8
  pour Top (isolate 0.254): 0.76,48.01 51.31,48.13 51.31,51.69 arc-90 55.5,53.09 68.2,53.09 68.2,61.59 74.55,61.59 74.55,78.11 0.76,78.23
  pour Top (isolate 0.406): 75.57,77.98 75.82,61.59 132.84,61.34 132.84,77.98
  pour Top (isolate 0.813): 52.45,49.4 52.7,31.11 67.44,31.11 67.44,33.02 64.77,33.02 64.77,41.02 55.5,41.27 55.37,42.16 55.37,49.4
GNDA  (via drill 0.3 pad 0.65, 0.35)
  Top 0.203: IC5.11 57.4,15.24 arc-90 56.77,14.61 55.5,14.61 55.5,10.16 53.59,10.16 arc90 53.46,10.03 C24.2 | C6.2 25.65,9.02 25.65,10.41 27.69,10.41 | 27.64,13.76 27.43,13.97
  Top 0.254: R18.2 30.71,23.37 GNDA.4 | GNDA.1 16.26,23.62 14.22,21.59 | C11.2 3.43,15.81 | 27.69,10.41 27.69,10.64 27.56,10.77 27.56,12.19 | 27.56,12.19 27.56,13.24 27.64,13.32 27.64,13.76 | 27.56,12.19 27.56,12.2 27.56,13.24 27.43,13.37 27.43,14.99 29.46,14.99 IC4.11 v29.97,18.8
  Bottom 0.254: GNDA.1 21.59,23.62 GNDA.2 24.13,23.37 GNDA.3 26.67,23.62 GNDA.4 27.43,20.32 27.43,19.3 27.94,18.8 v29.97,18.8
  other vias: 0.85,12.8 0.85,13.63
  pour Top (isolate 0.305): 0.25,21.34 73.91,21.59 73.91,6.35 0.25,6.35
HIN0  (via drill 0.25, 0.35)
  Top 0.152: 83.44,72.01 v83.31,72.14
  Top 0.254: v48.51,72.14 IC3.3 | U$4.12 83.44,72.01
  Bottom 0.254: v48.51,72.14 v83.31,72.14
HIN1  (via drill 0.25, 0.3 pad 0.65)
  Top 0.254: v44.7,70.61 IC3.6 | v95.83,70.61 U$11.12
  Bottom 0.152: 92.37,70.61 92.46,70.52
  Bottom 0.254: v44.7,70.61 92.37,70.61 | v95.83,70.61 92.46,70.52 92.12,70.51
HIN2  (via drill 0.25, 0.3 pad 0.65)
  Top 0.254: U$14.12 v108.84,68.45 | IC3.8 v43.43,58.42 | v89.15,60.96 v89.15,67.31
  Bottom 0.254: v43.43,58.42 44.7,58.42 47.24,60.96 v89.15,60.96 | v108.84,68.45 108.97,68.33 101.09,68.33 100.84,67.31 v89.15,67.31
HIN3  (via drill 0.25, 0.3 pad 0.65)
  Top 0.254: IC3.11 v47.24,58.42 | v114.55,59.94 v114.55,67.82 | v121.67,67.82 121.67,66.04 | 121.67,65.79 121.67,66.04 | 121.67,66.04 U$17.12
  Bottom 0.254: v47.24,58.42 61.85,58.42 61.85,59.69 v114.55,59.94 | v114.55,67.82 v121.67,67.82
HV_SENSE  (via drill 0.35)
  Top 0.254: R24.2 R23.1 65.69,34.75 v65.66,33.02
  Bottom 0.254: JP1.10 61.21,31.11 65.66,31.11 v65.66,33.02
I_SENSE_0  (via drill 0.35)
  Top 0.254: R16.2 20.42,8.91 C10.1 | 20.42,12.22 R16.2 | R16.2 19.94,12.06 18.67,13.34 18.67,19.05 20.57,20.95 46.61,20.95 v46.61,21.84
  Bottom 0.254: JP1.4 54.86,26.67 54.86,21.84 v46.61,21.84
I_SENSE_1  (via drill 0.35)
  Top 0.254: C25.1 48.36,8.91 R41.2 47.24,12.06 46.61,12.7 46.61,17.78 v49.78,20.95
  Bottom 0.254: v49.78,20.95 59.94,20.95 59.94,26.67 JP1.8
ID0  (via drill 0.25, 0.35)
  Top 0.254: R5.1 R6.2 84.86,17.63 v84.71,17.78 | IC4.10 30.73,18.41 30.86,18.8 v40.51,18.8 40.64,19.05
  Bottom 0.254: v84.71,17.78 84.07,19.68 40.89,19.68 v40.51,18.8
ID1  (via drill 0.25, 0.35)
  Top 0.254: IC5.10 58.67,18.41 59.31,19.05 68.83,19.05 v68.83,17.78 | R32.2 R31.1 v96.77,16.51
  Bottom 0.152: 72.64,13.34 72.64,17.78 v68.83,17.78 68.48,17.78
  Bottom 0.203: 83.44,13.34 72.64,13.34
  Bottom 0.254: v96.77,16.51 95.5,15.88 83.44,15.88 83.44,13.34
ID2
  Top 0.254: R48.1 R49.2
ID3
  Top 0.254: R57.1 R58.2 | R58.2 125.2,17.63 125.35,17.78 124.87,17.78 R58.2
LIN0  (via drill 0.25, 0.35)
  Top 0.254: IC2.1 v66.29,71.37 | U$4.14 80.9,71.25 v80.77,71.37
  Bottom 0.254: v66.29,71.37 v80.77,71.37
LIN1  (via drill 0.25, 0.3 pad 0.65)
  Top 0.254: IC2.4 v62.48,68.83 | v91.95,68.83 93.73,68.58 U$11.14
  Bottom 0.254: v62.48,68.83 v91.95,68.83
LIN2  (via drill 0.25, 0.3 pad 0.65)
  Top 0.254: U$14.14 106.3,66.42 v106.43,67.56 | IC2.10 v61.21,62.23 | v101.85,62.48 v101.85,67.31
  Bottom 0.254: v61.21,62.23 v101.85,62.48 | v101.85,67.31 101.85,67.44 v106.43,67.56
LIN3  (via drill 0.25, 0.3 pad 0.65)
  Top 0.254: U$17.14 119,66.42 119.13,66.55 119.13,71.5 124.71,71.5 v124.59,71.63 | IC2.13 v65.02,58.42
  Bottom 0.254: v124.59,71.63 124.71,71.63 124.71,68.45 124.71,63.5 119.63,58.42 v65.02,58.42
N$1
  Top 0.254: R1.2 86.61,35.02 U$2.1
N$2
  Top 0.254: R2.2 78.84,49.38 77.72,48.26 77.72,40.01 79.25,38.48 U$3.1 79.23,37.08
N$3
  Top 0.203: U$4.6 84.71,53.34 85.85,52.2 C1.2 84.2,52.2 84.07,52.07 84.07,46.99 81.53,44.45
  Top 0.254: 81.53,34.29 U$3.3 81.53,44.45 | 81.53,34.29 82.78,34.29 U$2.2 | R3.1 81.05,33.81 81.53,34.29
N$4
  Top 0.254: R5.2 R4.1 C3.1 78.86,25.4 77.72,25.4 77.34,25.78 77.34,30.1 78.21,30.96 R3.2
N$5
  Top 0.254: U$4.7 85.98,54.1 87.63,53.98 87.63,49.4 | 87.63,49.4 87.63,47.39 D1.C | C1.1 87.37,49.4 87.63,49.4
N$6
  Top 0.254: R1.1 87.78,39.52 88.39,40.13 88.39,54.91 U$4.8
N$7
  Top 0.254: U$4.1 R2.1
N$8  (via drill 0.25)
  Top 0.254: IC1.2 v34.54,68.07 | v49.78,68.07 IC3.2 | IC2.3 v63.75,68.07
  Bottom 0.254: v34.54,68.07 v49.78,68.07 v63.75,68.07
N$9
  Top 0.254: IC4.9 IC4.8 35.6,17.2 R12.1
N$10
  Top 0.254: IC1.1 35.81,69.34 C5.1 36.32,72.37 R9.2
N$11
  Top 0.254: R10.2 R16.1 23.33,12.01 IC4.1
N$12
  Top 0.254: R17.2 42.42,40.64 U$5.2
N$13
  Top 0.254: IC4.2 26.92,13.49 R13.2 R10.1
N$14
  Top 0.254: IC4.3 28.19,13.46 28.58,13.84 38.48,13.84 | 38.48,13.84 38.48,12.09 R11.1 | R12.2 38.51,13.87 38.48,13.84
N$15
  Top 0.254: IC4.5 31.37,10.41 33.4,10.41 33.4,8.91 R15.2 R14.2
N$16
  Top 0.254: IC4.6 IC4.7 35.6,12.01 R11.2
N$17
  Top 0.254: U8.7 22.79,46.03 23.11,46.35 26.92,46.35 28.83,44.45 L1.1
N$18
  Top 0.152: 39.62,35.32 39.77,35.46
  Top 0.254: U8.6 23.44,45.41 23.75,45.72 25.02,45.72 25.27,45.47 25.27,41.02 26.92,39.37 L1.2 35.05,39.37 C14.1 37.08,35.18 HV_IN.1 35.53,32.87 R19.1 | R17.1 39.77,35.46 39.73,35.08 | HV_IN.2 39.62,35.32
  Bottom 0.254: HV_IN.1 39.37,34.42 HV_IN.2 41.91,34.16 HV_IN.3 44.45,34.42 HV_IN.4
N$19
  Top 0.254: C11.1 5.48,17.91 U$7.4
N$20
  Top 0.254: U8.5 24.09,43.22 24.77,42.8 24.77,38.86 27.56,35.81 28.73,35.81 R20.2 R19.2
N$21
  Top 0.254: L2.2 16.17,43.86 D2.A 14.22,39.72 U$6.1
N$22
  Top 0.254: R27.2 99.31,35.02 U$9.1
N$23
  Top 0.254: R26.1 2.82,35.43 C17.2 5.99,35.41 R25.2 11.81,35.41 U$6.3
N$24
  Top 0.254: R21.1 R22.1
N$25
  Top 0.254: R28.2 91.54,49.38 90.42,49.53 90.42,39.91 91.95,38.38 U$10.1
N$26
  Top 0.254: 96.77,52.07 96.77,46.99 94.23,45.72 U$10.3 94.23,34.29 | 96.77,52.07 98.04,52.07 97.41,54.61 U$11.6 | C20.2 96.9,52.2 96.77,52.07 | 94.23,34.29 93.6,33.66 91.85,33.66 R29.1 | U$9.2 95.48,34.29 94.23,34.29
N$27
  Top 0.254: U$11.8 101.09,54.91 101.09,41.3 R27.1
N$28
  Top 0.254: U$11.1 R28.1
N$29
  Top 0.254: D3.C 99.33,46.5 100.33,47.5 100.33,49.53 | 100.33,49.53 100.33,53.98 98.68,54.36 U$11.7 | C20.1 100.2,49.4 100.33,49.53
N$30
  Top 0.254: R29.2 91.16,30.96 90.04,29.84 90.04,25.78 90.42,25.4 91.56,25.4 C22.1 R30.1 R31.2
N$31
  Top 0.254: IC5.9 IC5.8 63.54,17.2 R37.1
N$32
  Top 0.254: IC5.2 54.86,13.49 R38.2 51.05,17.14 48.51,14.61 R35.1
N$33
  Top 0.254: R37.2 66.45,13.97 | 66.45,13.97 R36.1 | IC5.3 56.13,13.34 56.77,13.97 66.45,13.97
N$34
  Top 0.254: IC5.6 60.58,12.01 | 60.58,12.01 IC5.7 | R36.2 60.64,12.06 60.58,12.01
N$35
  Top 0.254: R35.2 R41.1 53.53,12.06 IC5.1
N$36
  Top 0.254: IC5.5 58.67,10.29 61.37,10.29 R40.2 R39.2
N$37
  Top 0.254: U$7.3 10.73,16.82 11.05,16.51 11.05,15.24 | U$7.1 10.73,14.93 | 10.73,14.93 11.05,15.24 | 10.73,14.93 10.73,12.51 C13.1 | 11.05,15.24 12.8,15.24 R42.2
N$38  (via drill 0.25)
  Top 0.254: IC1.6 v29.46,64.77 | v45.97,64.77 IC3.5 | IC2.6 v59.94,64.77
  Bottom 0.254: v29.46,64.77 v45.97,64.77 v59.94,64.77
N$39
  Top 0.254: IC1.5 30.73,69.72 C26.1 30.86,72.37 R43.2
N$40
  Top 0.254: R44.2 112.01,35.02 U$12.1
N$41
  Top 0.254: R45.2 102.49,50.01 102.49,40.01 104.65,38.48 U$13.1
N$42
  Top 0.254: U$14.6 110.11,54.61 110.74,52.07 109.47,52.07 | 109.47,52.07 109.47,46.95 U$13.3 106.93,34.29 | C27.2 109.6,52.2 109.47,52.07 | 106.93,34.29 106.45,33.81 R46.1 | U$12.2 108.18,34.29 106.93,34.29
N$43
  Top 0.254: R44.1 112.04,39.52 113.79,41.27 113.79,54.91 U$14.8
N$44
  Top 0.254: U$14.1 R45.1
N$45
  Top 0.254: U$14.7 111.38,54.36 113.03,54.23 113.03,49.53 | 113.03,49.53 113.03,47.52 D4.C | C27.1 112.9,49.4 113.03,49.53
N$46
  Top 0.254: R46.2 103.73,30.96 102.74,29.97 102.74,25.78 103.12,25.4 104.26,25.4 C29.1 R47.1 R48.2
N$47  (via drill 0.25)
  Top 0.254: IC1.8 v28.19,62.23 | v45.97,62.23 IC3.10 | IC2.9 v59.94,62.23
  Bottom 0.254: v28.19,62.23 v45.97,62.23 v59.94,62.23
N$48
  Top 0.254: R53.2 124.71,35.02 U$15.1
N$49
  Top 0.254: IC1.9 29.46,57.28 C31.1 29.59,54 R52.2
N$50
  Top 0.254: R54.2 116.94,49.38 115.19,49.53 115.19,40.01 117.35,38.48 U$16.1
N$51
  Top 0.254: U$17.6 122.81,54.61 123.44,52.7 123.95,52.2 | C32.2 123.95,52.2 | 123.95,52.2 124.08,52.07 122.17,52.07 122.17,46.99 U$16.3 119.63,34.29 | 119.63,34.29 119,33.66 117.25,33.66 R55.1 | U$15.2 120.88,34.29 119.63,34.29
N$52
  Top 0.254: U$17.8 126.62,55.63 126.62,41.43 R53.1
N$53
  Top 0.254: U$17.1 R54.1
N$54
  Top 0.254: U$17.7 124.08,54.23 125.73,54.1 125.73,49.53 | 125.73,49.53 125.73,47.52 D5.C | C32.1 125.6,49.4 125.73,49.53
N$55
  Top 0.254: R55.2 116.31,30.96 115.19,29.84 115.19,26.04 115.82,25.4 116.96,25.4 C34.1 R56.1 R57.2 | R57.2 121.06,20.47 121.54,20.95 121.39,20.95 R57.2
N$56  (via drill 0.25)
  Top 0.254: IC1.12 33.27,58.42 32,57.15 v32,55.88 | v49.78,55.88 IC3.13 | IC2.12 v63.75,55.88
  Bottom 0.254: v32,55.88 v49.78,55.88 v63.75,55.88
N$57
  Top 0.254: IC1.13 34.41,60.3 C36.1 34.39,57.13 R61.2
N$58  (via drill 0.25)
  Top 0.254: IC2.5 v61.21,69.85 | v47.24,69.85 IC3.4 | R43.1 28.04,73.51 29.46,74.93 32,74.93 33.27,73.66 v33.27,69.85 32,68.58 IC1.4
  Bottom 0.254: v61.21,69.85 v47.24,69.85 v33.27,69.85
N$59  (via drill 0.25)
  Top 0.254: IC2.2 v65.02,71.37 | v51.05,71.37 IC3.1 | v40.89,72.39 40.26,73.03 R9.1 | IC1.10 30.73,62.23 29.46,63.5 25.65,63.5 25.02,64.14 v25.02,72.39
  Bottom 0.254: v65.02,71.37 v51.05,71.37 41.91,71.37 v40.89,72.39 v25.02,72.39
N$60
  Top 0.254: U$5.3 57.76,48.51 R21.2
N$62
  Top 0.254: R62.2 69.6,38.2 R63.1
PWM_0  (via drill 0.25, 0.3 pad 0.65)
  Top 0.254: IC1.11 v32,63.5 | v20.83,56.39 v20.83,65.28
  Bottom 0.254: v32,63.5 22.86,65.28 v20.83,65.28 | X5.14 v20.83,56.39
PWM_1  (via drill 0.25, 0.3 pad 0.65)
  Top 0.254: IC1.3 v33.27,68.58 | v22.35,67.06 v22.35,54.1
  Bottom 0.254: X5.16 14.73,54.1 v22.35,54.1 | v22.35,67.06 22.35,68.58 v33.27,68.58
PWM_2  (via drill 0.25)
  Top 0.254: v24.38,57.15 24.38,54.61 25.02,53.98 R52.1 | IC3.9 v44.7,57.15 | IC2.8 v58.67,57.15
  Bottom 0.254: v58.67,57.15 v44.7,57.15 v24.38,57.15 24.26,57.4 24.38,64.26 X5.8
PWM_3  (via drill 0.25)
  Top 0.254: IC2.11 v62.48,54.61 | v39.62,54.61 38.99,53.98 R61.1 | IC3.12 v48.51,54.61
  Bottom 0.254: v62.48,54.61 v48.51,54.61 v39.62,54.61 | v39.62,54.61 39.5,54.48 | X5.12 23.37,58.93 23.37,52.32 39.88,52.58 v39.62,54.61
SD_0  (via drill 0.3 pad 0.65)
  Top 0.254: U$4.13 82.17,73.28 v82.04,73.41
  Bottom 0.152: 13.46,71.88 X5.1
  Bottom 0.254: 13.46,71.88 13.46,73.66 82.04,73.66 v82.04,73.41
SD_1  (via drill 0.3 pad 0.65)
  Top 0.254: 94.87,71.75 94.87,71.89 | 94.87,71.89 v94.74,74.42 | 94.87,71.89 U$11.13
  Bottom 0.254: v94.74,74.42 12.45,74.42 12.45,69.09 X5.3
SD_2  (via drill 0.3 pad 0.65)
  Top 0.254: U$14.13 v107.57,71.5
  Bottom 0.254: v107.57,71.5 98.04,75.18 11.43,75.18 11.43,67.82 15.49,67.82 X5.6
SD_3  (via drill 0.3 pad 0.65)
  Top 0.254: U$17.13 v120.27,68.96
  Bottom 0.254: v120.27,68.96 120.14,72.9 98.5,76.01 10.92,75.95 10.57,75.86 10.57,62.74 14.73,62.74 X5.10
V+  (via drill 0.25)
  Top 0.254: U$2.3 85.38,26.71 v85.34,30.48 | U$9.3 98,26.71 v98.04,30.48 | R24.1 HV_OUT.4 | U$12.3 v110.74,30.48 | v123.44,30.48 U$15.3 | HV_OUT.1 73.13,44.09 R62.1 69.6,45.47 69.59,45.48 | 69.59,45.48 C16.1 | R22.2 68.99,47.6 69.6,46.99 69.6,45.49 69.59,45.48
  Bottom 0.254: HV_OUT.1 74.04,40.89 HV_OUT.2 73.79,38.35 HV_OUT.3 74.04,35.81 HV_OUT.4 76.49,35.56 v85.34,30.48 v98.04,30.48 v110.74,30.48 v123.44,30.48
V_SENSE_0  (via drill 0.35)
  Top 0.254: IC4.13 IC4.14 25.65,18.41 25.02,19.05 | R13.1 22.33,19.05 25.02,19.05 | 25.02,19.05 26.29,20.32 48.01,20.32 v48.01,22.86
  Bottom 0.254: JP1.2 52.32,26.67 52.32,22.86 v48.01,22.86
V_SENSE_1  (via drill 0.35)
  Top 0.254: R38.1 48.36,18.26 49.15,19.05 52.96,19.05 | 52.96,19.05 53.59,18.41 IC5.14 IC5.13 | v57.4,22.23 57.4,20.95 54.86,20.95 52.96,19.05
  Bottom 0.254: JP1.6 57.4,26.67 v57.4,22.23
VCC
  Top 0.203: 25.65,21.84 25.65,27.18 | JP2.8 35.31,30.35 35.31,30.48
  Top 0.254: U8.2 U8.3 23.44,36.02 C15.1 22.98,35.56 20.57,35.56 | 26.92,30.48 VCC.4 25.65,27.18 | J1.PWR 14.89,28.7 VCC.1 | R42.1 13.74,17.93 18.03,21.84 25.65,21.84 | 26.92,30.48 20.57,30.48 20.57,35.56 | 20.57,35.56 18.16,35.56 C19.1 18.03,37.97 | 18.03,37.97 L2.1 | 18.03,37.97 17.84,37.78 U$6.5 U$6.4 | 35.31,30.48 26.92,30.48
  Bottom 0.254: VCC.1 21.59,28.7 VCC.2 24.13,28.45 VCC.3 26.67,28.7 VCC.4
VD0  (via drill 0.25, 0.35)
  Top 0.254: R8.2 R7.1 v82.3,15.88 | IC4.12 28.19,19.05 28.83,19.68 42.16,19.68 v42.16,18.8
  Bottom 0.203: v82.3,15.88 75.18,15.88 75.18,19.05 | 50.55,19.05 v42.16,18.8
  Bottom 0.254: 75.18,19.05 50.55,19.05
VD1  (via drill 0.25, 0.35)
  Top 0.152: 70.87,19.68 70.74,17.27 v70.74,12.7
  Top 0.254: IC5.12 56.13,19.05 56.77,19.68 70.87,19.68 | R34.2 R33.1 v96.14,12.7
  Bottom 0.152: 72.64,12.7 v70.74,12.7
  Bottom 0.203: v96.14,12.7 85.34,12.7 | 84.71,12.7 72.64,12.7 72.52,12.7
  Bottom 0.254: 85.34,12.7 84.71,12.7
VD2
  Top 0.254: R50.1 R51.2
VD3
  Top 0.254: R60.2 R59.1
VDD  (via drill 0.3 pad 0.65, 0.35)
  Top 0.203: v57.4,10.29 57.4,8.89 56.39,8.89 | IC4.4 29.59,11.88 v30.1,10.41 29.46,10.29 29.46,8.89 | R15.1 29.46,8.89 | 29.46,8.89 C6.1
  Top 0.254: IC5.4 57.4,8.89 R40.1 | 56.39,8.89 C24.1 56.13,8.76
  Bottom 0.203: v30.1,10.41 29.46,10.29 29.46,7.24
  Bottom 0.254: 11.18,8.76 11.68,7.24 29.46,7.24 29.72,7.24 52.32,7.11 57.28,7.11 v57.4,10.29
VDDA  (via drill 0.25)
  Top 0.254: C4.1 84.71,69.08 U$4.11 v84.71,63.5 | C23.1 97.41,69.34 U$11.11 v97.41,63.5 | v71.37,63.5 71.37,62.87 70.74,62.23 68.96,62.23 C7.1 68.7,62.23 66.93,62.23 66.29,61.59 IC2.14 | v56.13,63.5 56.13,62.87 55.37,62.1 C9.1 51.56,62.1 51.05,61.59 IC3.14 | IC1.14 35.81,61.59 36.45,62.23 38.22,62.23 C8.1 40.76,62.1 40.89,62.23 | 40.89,62.23 40.89,48.9 40.26,48.26 v34.54,48.26 34.5,48.26 | 40.89,62.23 v40.89,63.5 | v110.11,63.5 U$14.11 110.11,69.34 C30.1 | v122.81,63.5 U$17.11 122.81,69.34 C35.1 | U$7.5 6.16,14.93 C12.1 3.3,9.15 VDDA.1
  Bottom 0.254: v40.89,63.5 v56.13,63.5 v71.37,63.5 v84.71,63.5 v97.41,63.5 v110.11,63.5 v122.81,63.5 | VDDA.1 5.71,9.02 VDDA.2 8.25,8.76 VDDA.3 | VDDA.3 10.79,9.02 VDDA.4 | VDDA.3 2.79,14.73 2.79,43.69 20.83,44.2 20.83,48.26 v34.54,48.26
VO0
  Top 0.152: 80.26,11.91 X1.1
  Top 0.254: R4.2 78.99,14.12 R7.2 80.26,11.91
VO1
  Top 0.203: R33.2 92.98,12.05 93.6,11.43 94.87,10.79
  Top 0.254: R30.2 91.69,14.45 R33.2 | 94.87,10.79 X2.1 94.87,7.62
VO2
  Top 0.254: R47.2 104.39,14.45 R50.2 104.88,11.71 108.08,8.51 X3.1
VO3
  Top 0.152: 119.63,11.43 X4.1
  Top 0.203: 117.09,13.97 119.63,11.43
  Top 0.254: R56.2 117.09,14.45 R59.2 117.09,13.97

### Text on the board
tPlace: 2.2uH | 3.3-9V 1.5W | CH0 | CH1 | GND | CH2 | CH3 | GND